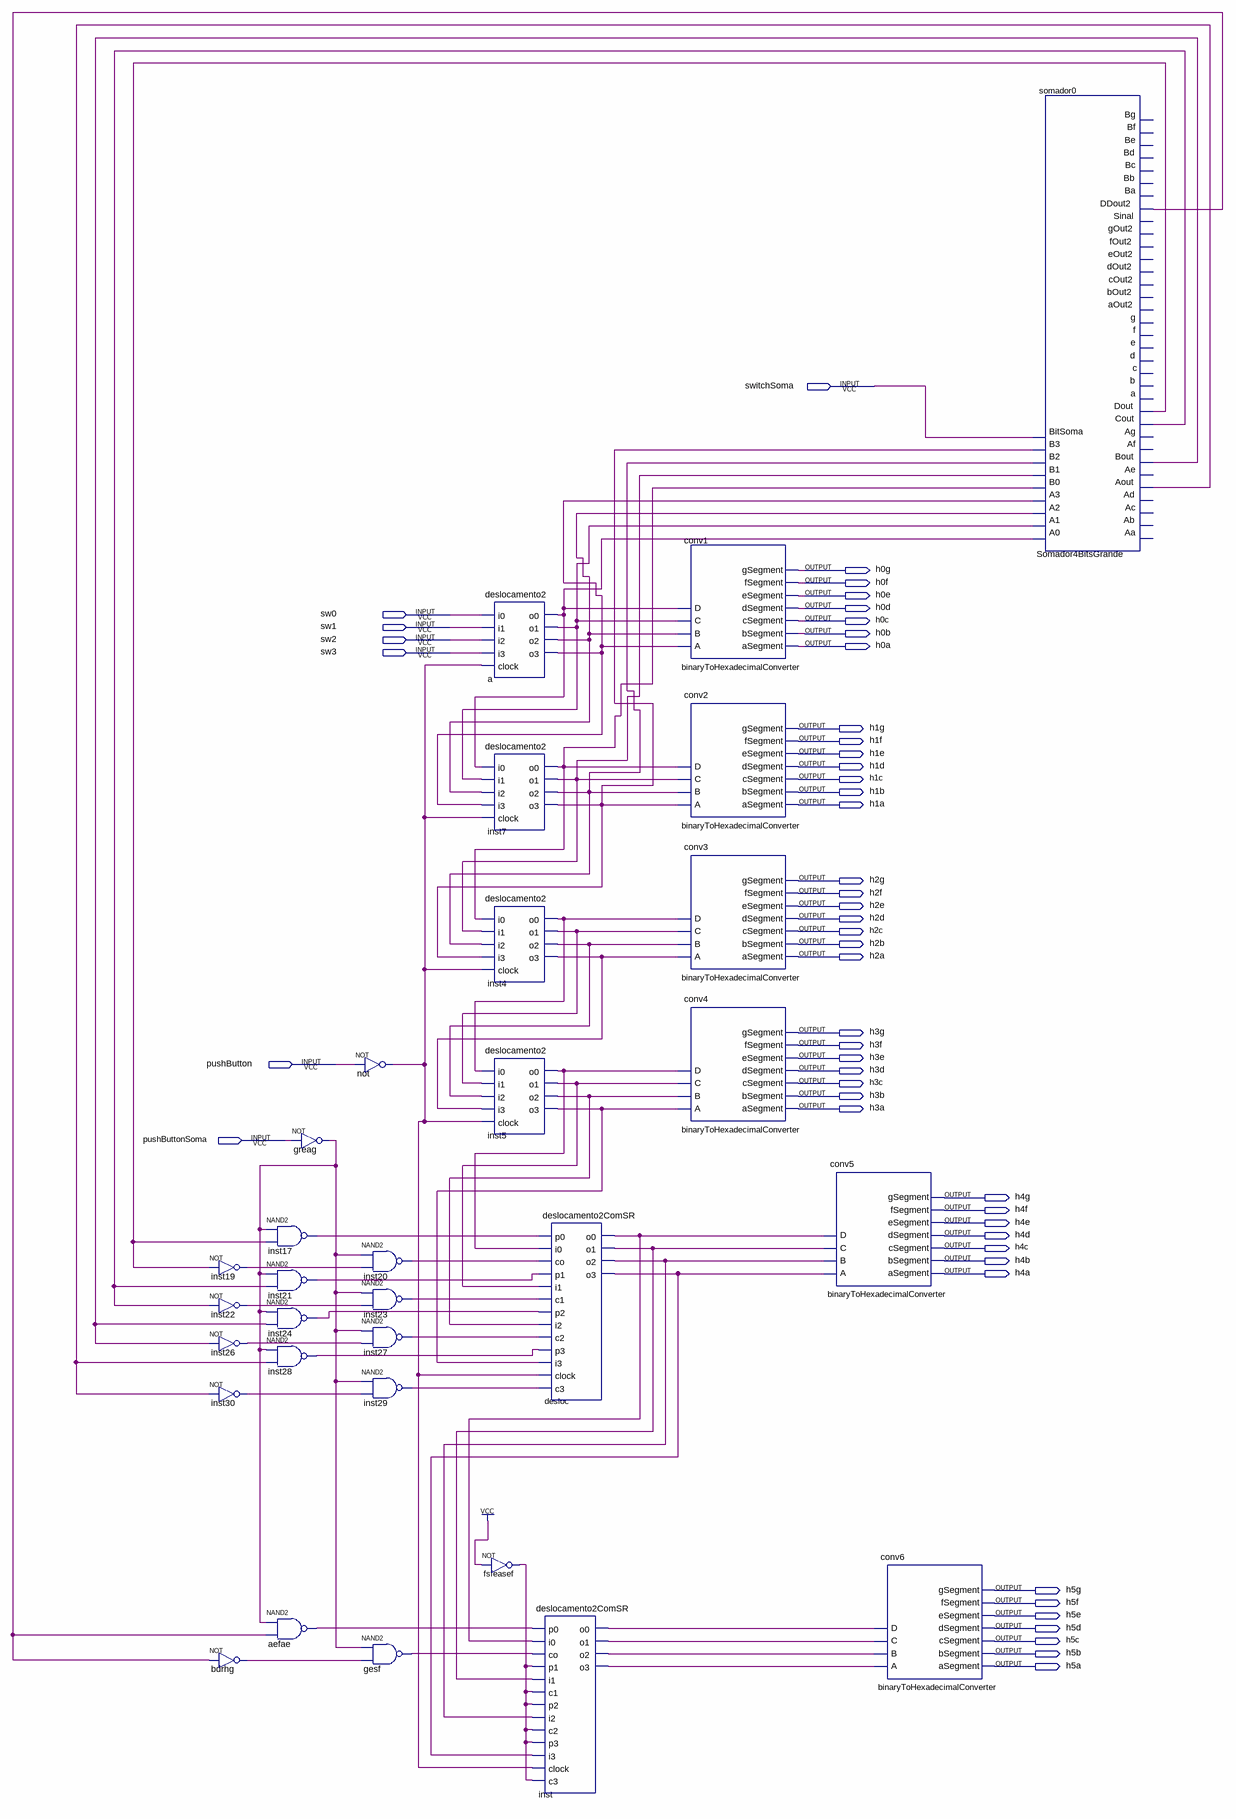
[diagram p0: schematic sheet]
// Quartus schematic deslocamentoGrande2.bdf as structural Verilog: 31 symbols, 49 pins
module deslocamentoGrande2 (
  input  switchSoma,
  input  sw0,
  input  sw1,
  input  sw2,
  input  sw3,
  input  pushButton,
  input  pushButtonSoma,
  output h0g,
  output h0f,
  output h0e,
  output h0d,
  output h0c,
  output h0b,
  output h0a,
  output h1g,
  output h1f,
  output h1e,
  output h1d,
  output h1c,
  output h1b,
  output h1a,
  output h2g,
  output h2f,
  output h2e,
  output h2d,
  output h2c,
  output h2b,
  output h2a,
  output h3g,
  output h3f,
  output h3e,
  output h3d,
  output h3c,
  output h3b,
  output h3a,
  output h4g,
  output h4f,
  output h4e,
  output h4d,
  output h4c,
  output h4b,
  output h4a,
  output h5g,
  output h5f,
  output h5e,
  output h5d,
  output h5c,
  output h5b,
  output h5a
);

  wire a_o0, a_o1, a_o2, a_o3, aefae_out, bdrhg_out, desloc_o0, desloc_o1, desloc_o2, desloc_o3,
       fsfeasef_out, gesf_out, greag_out, inst4_o0, inst4_o1, inst4_o2, inst4_o3, inst5_o0, inst5_o1,
       inst5_o2, inst5_o3, inst7_o0, inst7_o1, inst7_o2, inst7_o3, inst17_out, inst19_out, inst20_out,
       inst21_out, inst22_out, inst23_out, inst24_out, inst26_out, inst27_out, inst28_out, inst29_out,
       inst30_out, inst_o0, inst_o1, inst_o2, inst_o3, not_out, somador0_aout, somador0_bout, somador0_cout,
       somador0_ddout2, somador0_dout;

  not inst19 (inst19_out, somador0_dout);
  not inst22 (inst22_out, somador0_cout);
  not inst26 (inst26_out, somador0_bout);
  not inst30 (inst30_out, somador0_aout);
  not bdrhg (bdrhg_out, somador0_ddout2);
  not greag (greag_out, pushButtonSoma);
  nand inst17 (inst17_out, greag_out, somador0_dout);
  nand inst21 (inst21_out, greag_out, somador0_cout);
  nand inst24 (inst24_out, greag_out, somador0_bout);
  nand inst28 (inst28_out, greag_out, somador0_aout);
  nand aefae (aefae_out, greag_out, somador0_ddout2);
  not \not  (not_out, pushButton);
  nand inst20 (inst20_out, greag_out, inst19_out);
  nand inst23 (inst23_out, greag_out, inst22_out);
  nand inst27 (inst27_out, greag_out, inst26_out);
  nand inst29 (inst29_out, greag_out, inst30_out);
  nand gesf (gesf_out, greag_out, bdrhg_out);
  deslocamento2 a (.i0(sw0), .i1(sw1), .i2(sw2), .i3(sw3), .clock(not_out), .o0(a_o0), .o1(a_o1), .o2(a_o2), .o3(a_o3));
  deslocamento2 inst7 (
    .i0(a_o0), .i1(a_o1), .i2(a_o2), .i3(a_o3), .clock(not_out), .o0(inst7_o0), .o1(inst7_o1), .o2(inst7_o2),
    .o3(inst7_o3));
  deslocamento2 inst4 (
    .i0(inst7_o0), .i1(inst7_o1), .i2(inst7_o2), .i3(inst7_o3), .clock(not_out), .o0(inst4_o0),
    .o1(inst4_o1), .o2(inst4_o2), .o3(inst4_o3));
  deslocamento2 inst5 (
    .i0(inst4_o0), .i1(inst4_o1), .i2(inst4_o2), .i3(inst4_o3), .clock(not_out), .o0(inst5_o0),
    .o1(inst5_o1), .o2(inst5_o2), .o3(inst5_o3));
  not fsfeasef (fsfeasef_out, 1'b1);
  deslocamento2ComSR desloc (
    .p0(inst17_out), .i0(inst5_o0), .co(inst20_out), .p1(inst21_out), .i1(inst5_o1), .c1(inst23_out),
    .p2(inst24_out), .i2(inst5_o2), .c2(inst27_out), .p3(inst28_out), .i3(inst5_o3), .clock(not_out),
    .c3(inst29_out), .o0(desloc_o0), .o1(desloc_o1), .o2(desloc_o2), .o3(desloc_o3));
  deslocamento2ComSR inst (
    .p0(aefae_out), .i0(desloc_o0), .co(gesf_out), .p1(fsfeasef_out), .i1(desloc_o1), .c1(fsfeasef_out),
    .p2(fsfeasef_out), .i2(desloc_o2), .c2(fsfeasef_out), .p3(fsfeasef_out), .i3(desloc_o3), .clock(not_out),
    .c3(fsfeasef_out), .o0(inst_o0), .o1(inst_o1), .o2(inst_o2), .o3(inst_o3));
  binaryToHexadecimalConverter conv1 (
    .A(a_o3), .B(a_o2), .C(a_o1), .D(a_o0), .aSegment(h0a), .bSegment(h0b), .cSegment(h0c), .dSegment(h0d),
    .eSegment(h0e), .fSegment(h0f), .gSegment(h0g));
  binaryToHexadecimalConverter conv2 (
    .A(inst7_o3), .B(inst7_o2), .C(inst7_o1), .D(inst7_o0), .aSegment(h1a), .bSegment(h1b), .cSegment(h1c),
    .dSegment(h1d), .eSegment(h1e), .fSegment(h1f), .gSegment(h1g));
  binaryToHexadecimalConverter conv3 (
    .A(inst4_o3), .B(inst4_o2), .C(inst4_o1), .D(inst4_o0), .aSegment(h2a), .bSegment(h2b), .cSegment(h2c),
    .dSegment(h2d), .eSegment(h2e), .fSegment(h2f), .gSegment(h2g));
  binaryToHexadecimalConverter conv4 (
    .A(inst5_o3), .B(inst5_o2), .C(inst5_o1), .D(inst5_o0), .aSegment(h3a), .bSegment(h3b), .cSegment(h3c),
    .dSegment(h3d), .eSegment(h3e), .fSegment(h3f), .gSegment(h3g));
  binaryToHexadecimalConverter conv5 (
    .A(desloc_o3), .B(desloc_o2), .C(desloc_o1), .D(desloc_o0), .aSegment(h4a), .bSegment(h4b),
    .cSegment(h4c), .dSegment(h4d), .eSegment(h4e), .fSegment(h4f), .gSegment(h4g));
  binaryToHexadecimalConverter conv6 (
    .A(inst_o3), .B(inst_o2), .C(inst_o1), .D(inst_o0), .aSegment(h5a), .bSegment(h5b), .cSegment(h5c),
    .dSegment(h5d), .eSegment(h5e), .fSegment(h5f), .gSegment(h5g));
  Somador4BitsGrande somador0 (
    .A0(a_o0), .A1(a_o1), .A2(a_o2), .A3(a_o3), .B0(inst7_o0), .B1(inst7_o1), .B2(inst7_o2), .B3(inst7_o3),
    .BitSoma(switchSoma), .Aout(somador0_aout), .Bout(somador0_bout), .Cout(somador0_cout),
    .Dout(somador0_dout), .DDout2(somador0_ddout2));  // open: Aa, Ab, Ac, Ad, Ae, Af, Ag, a, b, c, d, e, f, g, aOut2, bOut2, cOut2, dOut2, eOut2, fOut2, gOut2, Sinal, Ba, Bb, Bc, Bd, Be, Bf, Bg
endmodule
